# EAGLE design PickupDaughterBoard (EAGLE 7.7.0)
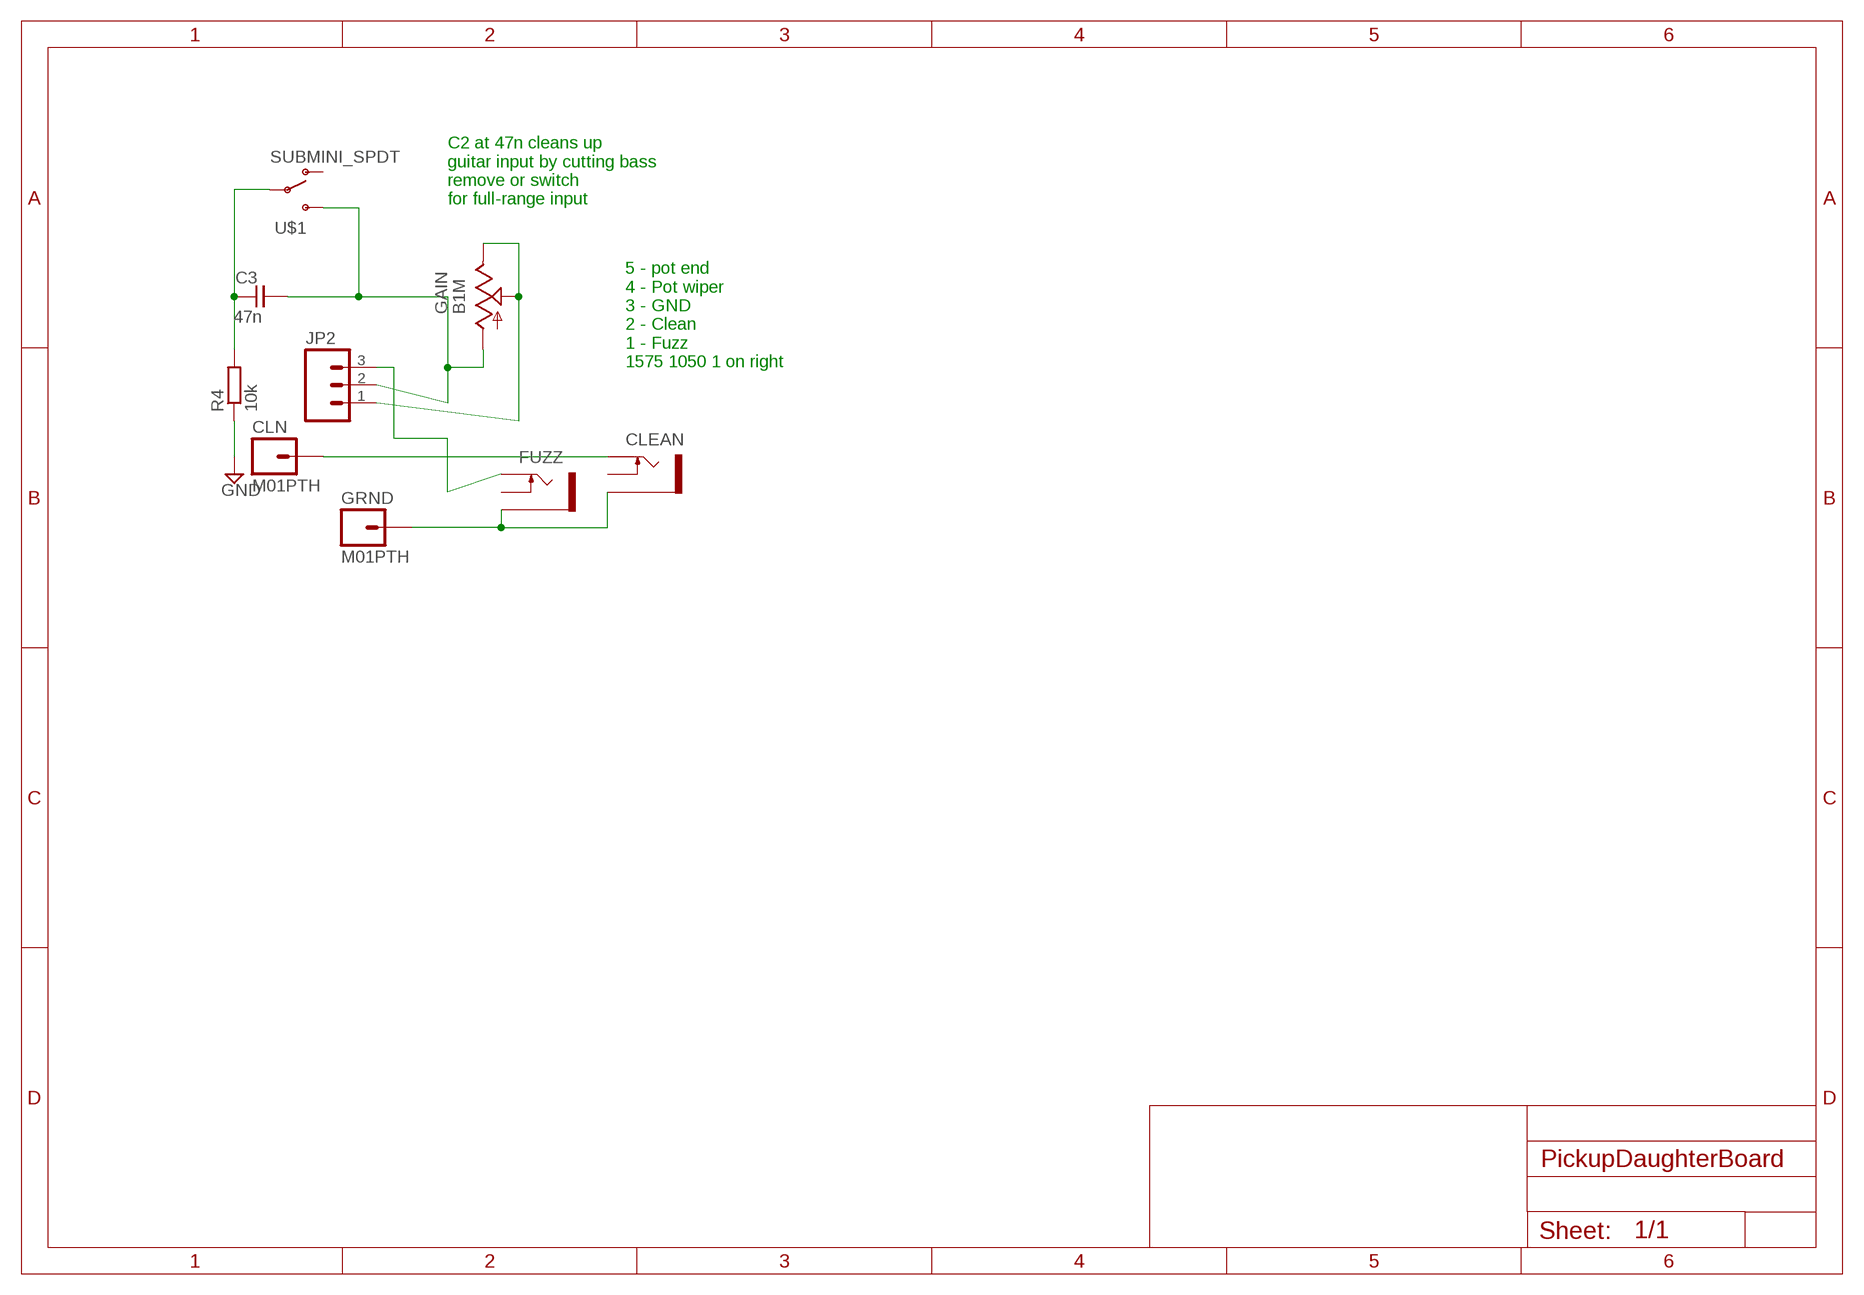
[diagram p0: schematic, sheet 1]

## Parts
C3  47n  C-EU050-024X044  [C050-024X044]
CLEAN  THONKICONNNEW  [WQP-PJ301M-12_JACK]
CLN  M01PTH  [1X01]
FUZZ  THONKICONNNEW  [WQP-PJ301M-12_JACK]
GAIN  B1M  ALPHA-9MMF2A  [EVUF]
GRND  M01PTH  [1X01]
JP2  M03PTH  [1X03]
R4  10k  RESISTORVERTICAL  [VERTICAL_RESISTOR]
U$1  SUBMINI_SPDT  [SUBMINI_TOGGLE]

## Nets
CLEAN: CLEAN.P$1_TIP(TIP) CLN.1
END: C3.1 GAIN.1(A) JP2.2 U$1.3(S)
FUZZ: FUZZ.P$1_TIP(TIP) JP2.3
GND: CLEAN.P$3_SLEEVE(SLEEVE) FUZZ.P$3_SLEEVE(SLEEVE) GRND.1 R4.1
N$7: C3.2 R4.2 U$1.COM(COMMON)
WIPER: GAIN.2(S) GAIN.3(E) JP2.1
Unconnected: CLEAN.P$2_SWITCH(SWITCH) FUZZ.P$2_SWITCH(SWITCH) U$1.1(O)

## Notes on the sheet
- C2 at 47n cleans up
  guitar input by cutting bass
  remove or switch 
  for full-range input
- 5 - pot end
  4 - Pot wiper
  3 - GND
  2 - Clean
  1 - Fuzz
  1575 1050 1 on right

## Library data of the parts
C3 = TomW:C-EU: CAPACITOR, European symbol
CLEAN FUZZ = MusicThingModular:THONKICONN: 3.5mm socket for Eurorack modular synths
CLN GRND = SparkFun-Connectors:M01: Header 1 Standard 1-pin 0.1" header. Use with straight break away headers (SKU : PRT-00116), right angle break away headers (PRT-00553), swiss pins (PRT-00743), machine pins (PRT-00117), and female headers (PRT-00115).
GAIN = TomW:ALPHA-9MM: 9 mm Square Rotary Potentiometers Source: Panasonic
JP2 = SparkFun-Connectors:M03: Header 3 Standard 3-pin 0.1" header. Use with straight break away headers (SKU : PRT-00116), right angle break away headers (PRT-00553), swiss pins (PRT-00743), machine pins (PRT-00117), and female headers (PRT-00115). Molex polarized connector foot print use with SKU : PRT-08232 with associated crimp pins and housings.
R4 = MusicThingModular:RESISTOR: Standard resistor, various versions
U$1 = MusicThingModular:SUBMINI_SPDT

## Net classes
1 power: width 0.406 mm
2 ground: width 0.203 mm

## Board
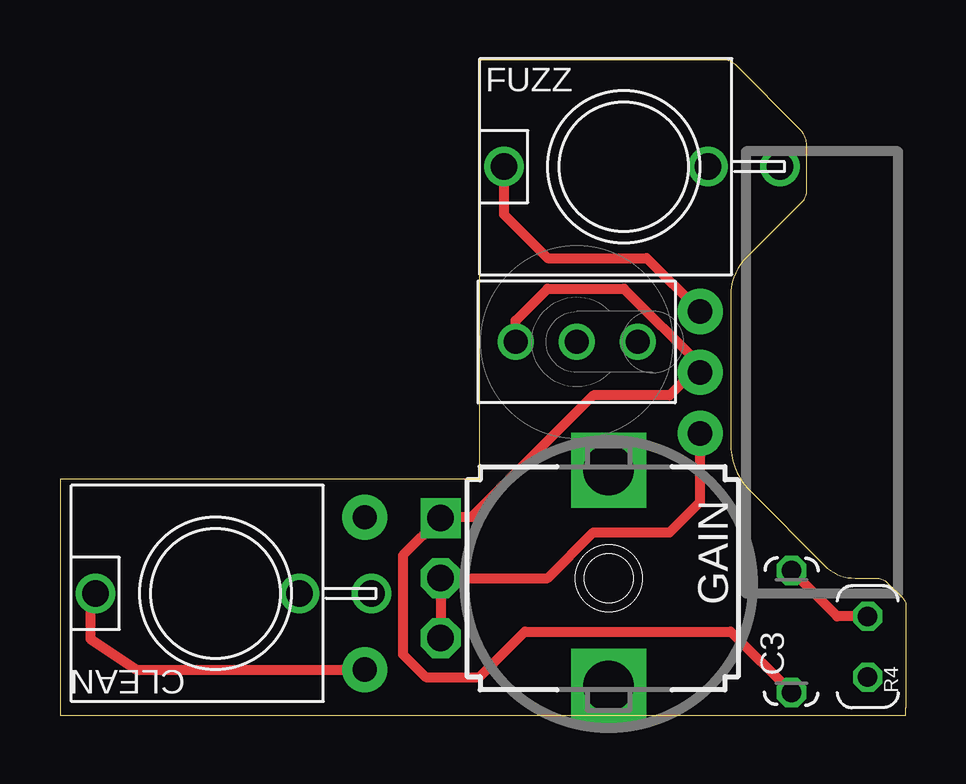
[diagram p1: board, top side]
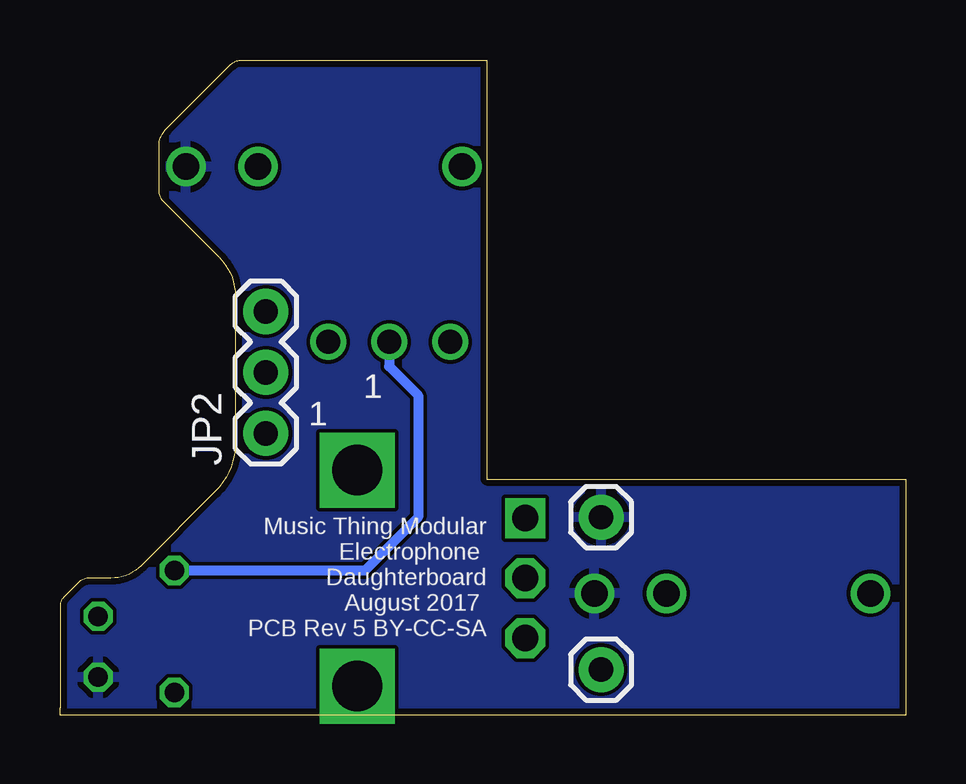
[diagram p2: board, bottom side, seen from below]

Size 35.24 x 27.3 mm. Coordinates in mm from the lower left corner, seen from the top.
Outline: 0,9.84 0,0 35.24,0 35.24,0.32 35.24,4.58 arc45 35.11,4.89 34.48,5.53 arc45 34.03,5.71 33.13,5.71 arc-45 31.86,6.24 28.77,9.33 arc-45 27.94,11.34 27.94,17.47 arc-45 28.61,19.09 30.93,21.4 arc45 31.11,21.85 31.11,23.76 arc45 30.85,24.39 28.13,27.12 arc45 27.68,27.3 17.46,27.3 17.46,9.84 0,9.84
Copper layers (1*16): Top 0.035mm / dielectric 0.2mm / Bottom 0.035mm
Design rules "SeeedStudio_DRU_no_angle_20130527 *": minimum track width 6mil, minimum drill 12mil, track to track 6mil, track to pad 6mil, pad to pad 6mil, via to via 6mil, smd to smd 0mil, copper to edge 10mil, drill to drill 10mil, minimum pad ring 6mil, minimum via ring 6mil, stop-mask expansion 2mil, vias tented up to drill 25mil, thermal gap 10mil

### Footprints (pad centres in the part's own frame; a part is rotated, then mirrored left to right if it is on the bottom)
C050-024X044 = drill 0.813 octagon: 1 -2.54,0; 2 2.54,0
WQP-PJ301M-12_JACK = drill 1.1: P$1_TIP 0,5; P$2_SWITCH 0,-3.5; P$3_SLEEVE 0,-6.5
1X01 = drill 1.016 pad 1.88: 1 0,0
EVUF = drill 1.1 pad 1.676 square: 1 -2.5,-7 | drill 1.1 pad 1.676 octagon: 2 0,-7; 3 2.5,-7 | drill 2.1 pad 2.8 square: M1 4.5,0; M2 -4.5,0
1X03 = drill 1.016 pad 1.88: 1 0,0; 2 2.54,0; 3 5.08,0
VERTICAL_RESISTOR = drill 0.813 octagon: 1 -1.27,0; 2 1.27,0
SUBMINI_TOGGLE = drill 1 pad 1.422: 1 -2.54,0; 3 2.54,0; COM 0,0

### Placement (x,y rotation side)
C3  30.48,3.49 90 top
CLEAN  6.48,5.08 90 top
CLN  12.7,1.91 0 bottom
FUZZ  23.5,22.86 90 top
GAIN  22.86,5.71 270 top
GRND  12.7,8.26 0 bottom
JP2  26.67,11.75 90 bottom
R4  33.66,2.86 90 top
U$1  21.53,15.56 180 top

### Tracks (layer width: path | path; a pad name or v marks a point on that pad's centre or on a via)
CLEAN
  Top 0.406: CLEAN.P$1_TIP 1.27,5.08 1.27,3.17 3.17,1.91 CLN.1
END
  Top 0.406: U$1.3 18.99,16.45 20.32,17.78 23.5,17.78 26.67,14.61 JP2.2 26.35,14.29 25.4,13.34 22.23,13.34 17.14,8.26 15.9,8.26 GAIN.1 15.84,8.21 14.29,6.67 14.29,2.54 15.24,1.59 17.46,1.59 19.37,3.49 27.94,3.49 C3.1
FUZZ
  Top 0.406: FUZZ.P$1_TIP 18.5,20.88 20.32,19.05 24.45,19.05 JP2.3
GND
  pour Bottom: -1.91,30.8 -1.27,-1.27 43.92,-2.54 43.92,32.07
N$7
  Top 0.406: R4.2 32.38,4.13 C3.2
  Bottom 0.406: U$1.COM 21.53,14.54 20.32,13.34 20.32,8.26 22.54,6.03 C3.2
WIPER
  Top 0.406: GAIN.3 GAIN.2 20.32,5.71 22.23,7.62 25.4,7.62 26.67,8.89 JP2.1

### Text on the board
bPlace: 1 | 1 | Music Thing Modular / Electrophone / Daughterboard / August 2017 / PCB Rev 5 BY-CC-SA